# EAGLE design ServoShield (EAGLE 9.6.2)
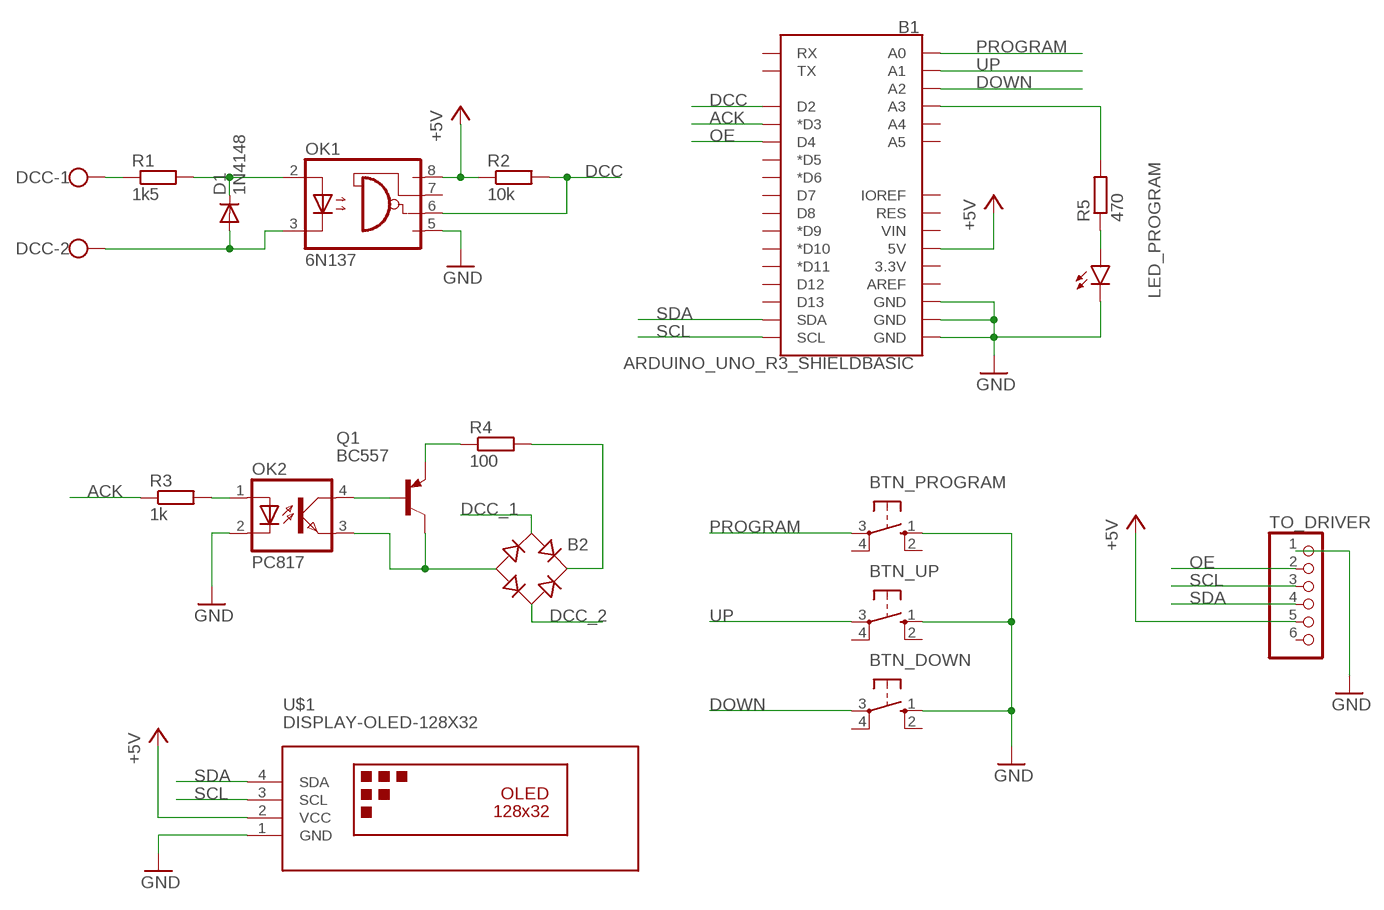
[diagram p0: schematic, sheet 1]

## Parts
B1  ARDUINO_UNO_R3_SHIELDBASIC  [UNO_R3_SHIELD]
B2  RB1A  [RB1A]
BTN_DOWN  10-XX  [B3F-10XX]
BTN_PROGRAM  10-XX  [B3F-10XX]
BTN_UP  10-XX  [B3F-10XX]
D1  1N4148  1N4148DO35-7  [DO35-7]
DCC  W237-102  [W237-102]
LED_PROGRAM  LED3MM  [LED3MM]
OK1  6N137  [DIL08]
OK2  PC817  [DIL04]
Q1  BC557  [TO92]
R1  1k5  R-EU_0207/2V  [0207/2V]
R2  10k  R-EU_0207/2V  [0207/2V]
R3  1k  R-EU_0207/2V  [0207/2V]
R4  100  R-EU_0207/2V  [0207/2V]
R5  470  R-EU_0207/2V  [0207/2V]
TO_DRIVER  PINHD-1X6  [1X06]
U$1  DISPLAY-OLED-128X32  [DISPLAY-OLED-128X32]

## Nets
+5V: B1.5V OK1.8(VCC) R2.1 TO_DRIVER.5 U$1.2(VCC)
ACK: B1.D3(*D3) R3.1
DCC [dcc]: B1.D2 OK1.6(VO) R2.2
DCC_1 [dcc]: B2.AC1 DCC.1 R1.1
DCC_2 [dcc]: B2.AC2 D1.A DCC.2 OK1.3(C)
DOWN: B1.A2 BTN_DOWN.3(P)
GND: B1.GND@0(GND) B1.GND@1(GND) B1.GND@2(GND) BTN_DOWN.1(S) BTN_PROGRAM.1(S) BTN_UP.1(S) LED_PROGRAM.K(C) OK1.5(GND) OK2.2(C) TO_DRIVER.1 U$1.1(GND)
N$1: B2.- OK2.3(EMIT) Q1.3(C)
N$2: D1.C OK1.2(A) R1.2
N$3: B1.A3 R5.2
N$4: LED_PROGRAM.A R5.1
N$8: OK2.1(A) R3.2
N$9: OK2.4(COL) Q1.2(B)
N$10: Q1.1(E) R4.1
N$11: B2.+ R4.2
OE: B1.D4 TO_DRIVER.2
PROGRAM: B1.A0 BTN_PROGRAM.3(P)
SCL: B1.SCL TO_DRIVER.3 U$1.3(SCL)
SDA: B1.SDA TO_DRIVER.4 U$1.4(SDA)
UP: B1.A1 BTN_UP.3(P)
Unconnected: B1.3.3V B1.A4 B1.A5 B1.AREF B1.D5(*D5) B1.D6(*D6) B1.D7 B1.D8 B1.D9(*D9) B1.D10(*D10) B1.D11(*D11) B1.D12 B1.D13 B1.IOREF B1.RES B1.RX B1.TX B1.VIN BTN_DOWN.2(S1) BTN_DOWN.4(P1) BTN_PROGRAM.2(S1) BTN_PROGRAM.4(P1) BTN_UP.2(S1) BTN_UP.4(P1) OK1.7(VE) TO_DRIVER.6

## Library data of the parts
B1 = SparkFun-Boards:ARDUINO_UNO_R3_SHIELD: Arduino R3 Shield Footprint Shield form compatible with the Arduino Uno R3. SparkFun Products: MG2639 Cellular Shield <https://www.sparkfun.com/products/13120> MIDI Shield <https://www.sparkfun.com/products/12898> R3 Stackable Headers Kit <https://www.sparkfun.com/products/11417>
B2 = rectifier:RB1A: RECTIFIER 1 A
BTN_DOWN BTN_PROGRAM BTN_UP = switch-omron:10-XX: OMRON SWITCH; MPN: B3F-1000; OC_FARNELL: 176432; OC_NEWARK: 36M3542
D1 = diode:1N4148: DIODE high speed (Philips)
DCC = con-wago-500:W237-102: WAGO SCREW CLAMP; MPN: 237-102; OC_FARNELL: unknown; OC_NEWARK: 70K9898
LED_PROGRAM = led:LED: LED OSRAM: - CHIPLED LG R971, LG N971, LY N971, LG Q971, LY Q971, LO R971, LY R971 LH N974, LH R974 LS Q976, LO Q976, LY Q976 LO Q996 - Hyper CHIPLED LW Q18S LB Q993, LB Q99A, LB R99A - SideLED LS A670, LO A670, LY A670, LG A670, LP A670 LB A673, LV A673, LT A673, LW A673 LH A674 LY A675 LS A676, LA A676, LO A676, LY A676, LW A676 LS A679, LY A679, LG A679 - Hyper Micro SIDELED® LS Y876, LA Y876, LO Y876, LY Y876 LT Y87S - SmartLED LW L88C, LW L88S LB L89C, LB L89S, LG L890 LS L89K, LO L89K, LY L89K LS L896, LA L896, LO L896, LY L896 - TOPLED LS T670, LO T670, LY T670, LG T670, LP T670 LSG T670, LSP T670, LSY T670, LOP T670, LYG T670 LG T671, LOG T671, LSG T671 LB T673, LV T673, LT T673, LW T673 LH T674 LS T676, LA T676, LO T676, LY T676, LB T676, LH T676, LSB T676, LW T676 LB T67C, LV T67C, LT T67C, LS T67K, LO T67K, LY T67K, LW E67C LS E67B, LA E67B, LO E67B, LY E67B, LB E67C, LV E67C, LT E67C LW T67C LS T679, LY T679, LG T679 LS T770, LO T770, LY T770, LG T770, LP T770 LB T773, LV T773, LT T773, LW T773 LH T774 LS E675, LA E675, LY E675, LS T675 LS T776, LA T776, LO T776, LY T776, LB T776 LHGB T686 LT T68C, LB T68C - Hyper Mini TOPLED® LB M676 - Mini TOPLED Santana® LG M470 LS M47K, LO M47K, LY M47K Source: http://www.osram.convergy.de LUXEON: - LUMILED® LXK2-PW12-R00, LXK2-PW12-S00, LXK2-PW14-U00, LXK2-PW14-V00 LXK2-PM12-R00, LXK2-PM12-S00, LXK2-PM14-U00 LXK2-PE12-Q00, LXK2-PE12-R00, LXK2-PE12-S00, LXK2-PE14-T00, LXK2-PE14-U00 LXK2-PB12-K00, LXK2-PB12-L00, LXK2-PB12-M00, LXK2-PB14-N00, LXK2-PB14-P00, LXK2-PB14-Q00 LXK2-PR12-L00, LXK2-PR12-M00, LXK2-PR14-Q00, LXK2-PR14-R00 LXK2-PD12-Q00, LXK2-PD12-R00, LXK2-PD12-S00 LXK2-PH12-R00, LXK2-PH12-S00 LXK2-PL12-P00, LXK2-PL12-Q00, LXK2-PL12-R00 Source: www.luxeon.com KINGBRIGHT: KA-3528ASYC Source: www.kingbright.com
OK1 = optocoupler:6N137: MOTOROLA OPTO COUPLER; MPN: 6N137; OC_FARNELL: 1328376; OC_NEWARK: 52M1895
OK2 = optocoupler:PC817: SHARP OPTO COUPLER; MPN: PC817X4J000F; OC_FARNELL: 9707727; OC_NEWARK: 97K7059
Q1 = transistor-pnp:BC557: PNP Transistor
R1-R5 = rcl:R-EU_: RESISTOR, European symbol
TO_DRIVER = pinhead:PINHD-1X6: PIN HEADER
U$1 = diy-modules:DISPLAY-OLED-128X32: 128x32 Dot Matrix OLED Module with I2C interface based on SSD1306 chip More details available here: http://www.tinyosshop.com/index.php?route=product/product&product_id=953 Schematic available here: http://www.tinyosshop.com/datasheet/OLED%2012832.pdf SSD1306 datasheet: https://cdn-shop.adafruit.com/datasheets/SSD1306.pdf Click here to find device on ebay.com <http://www.ebay.com/sch/oled+display+128x32+i2c>

## Net classes
1 dcc: width 0.406 mm

## Board
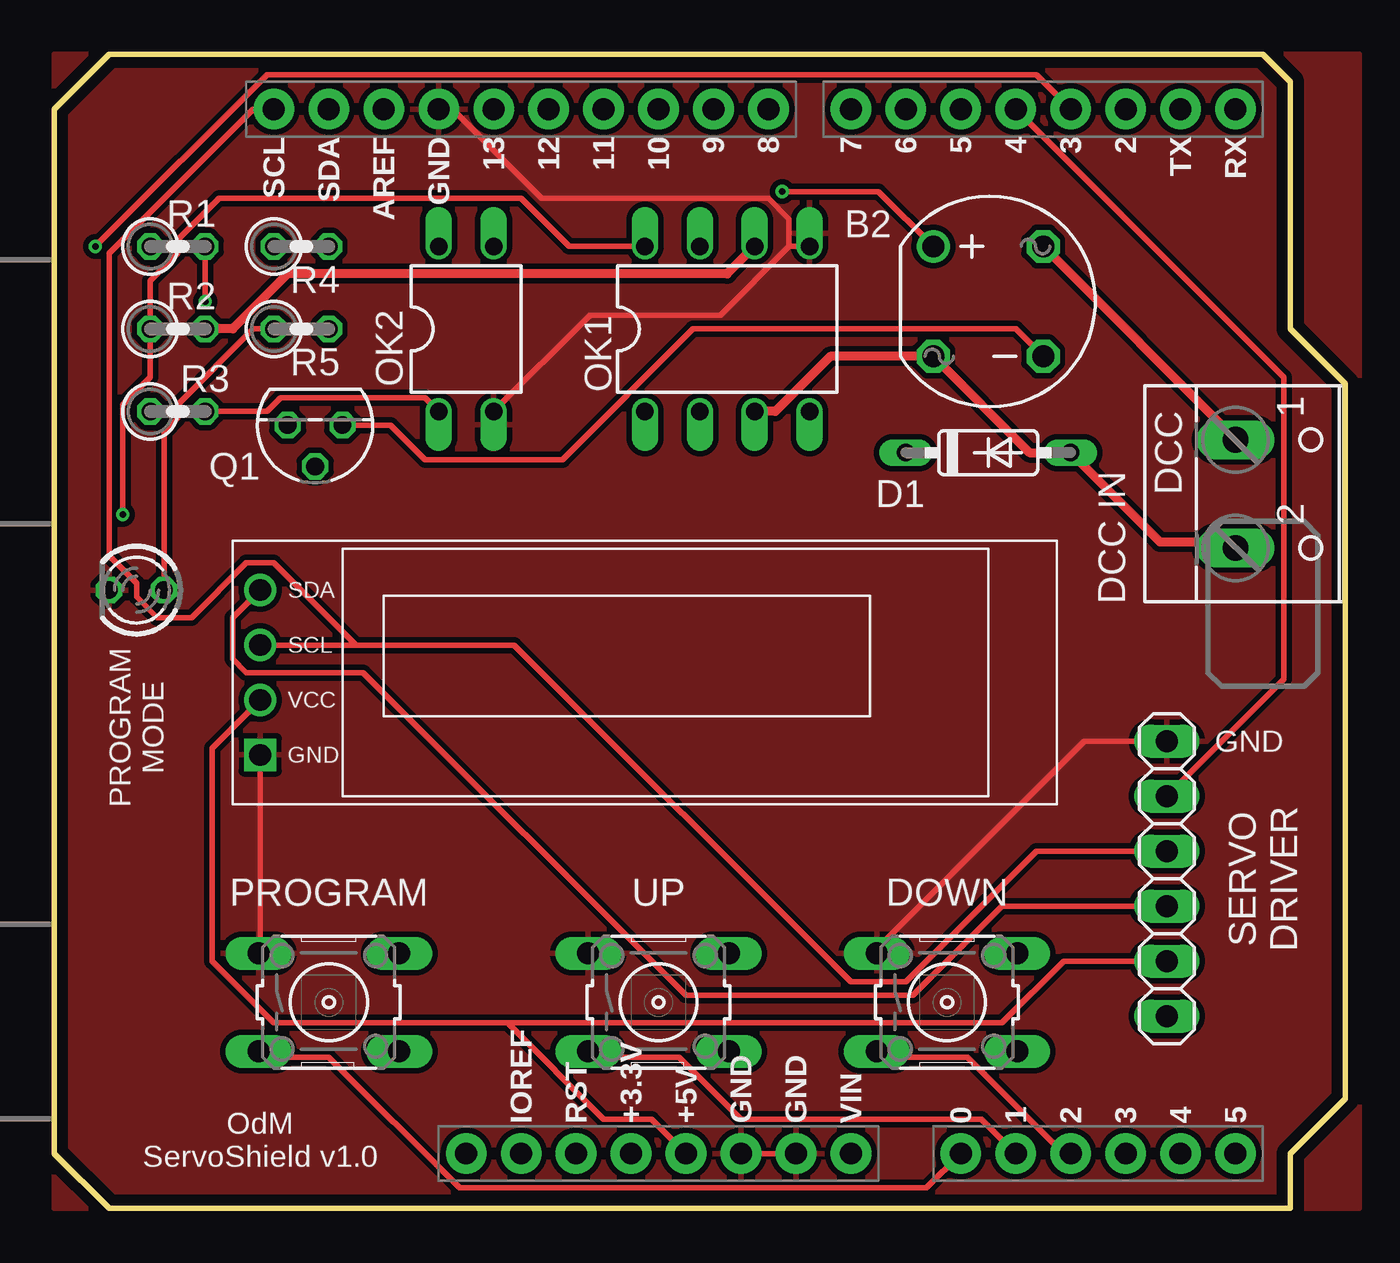
[diagram p1: board, top side]
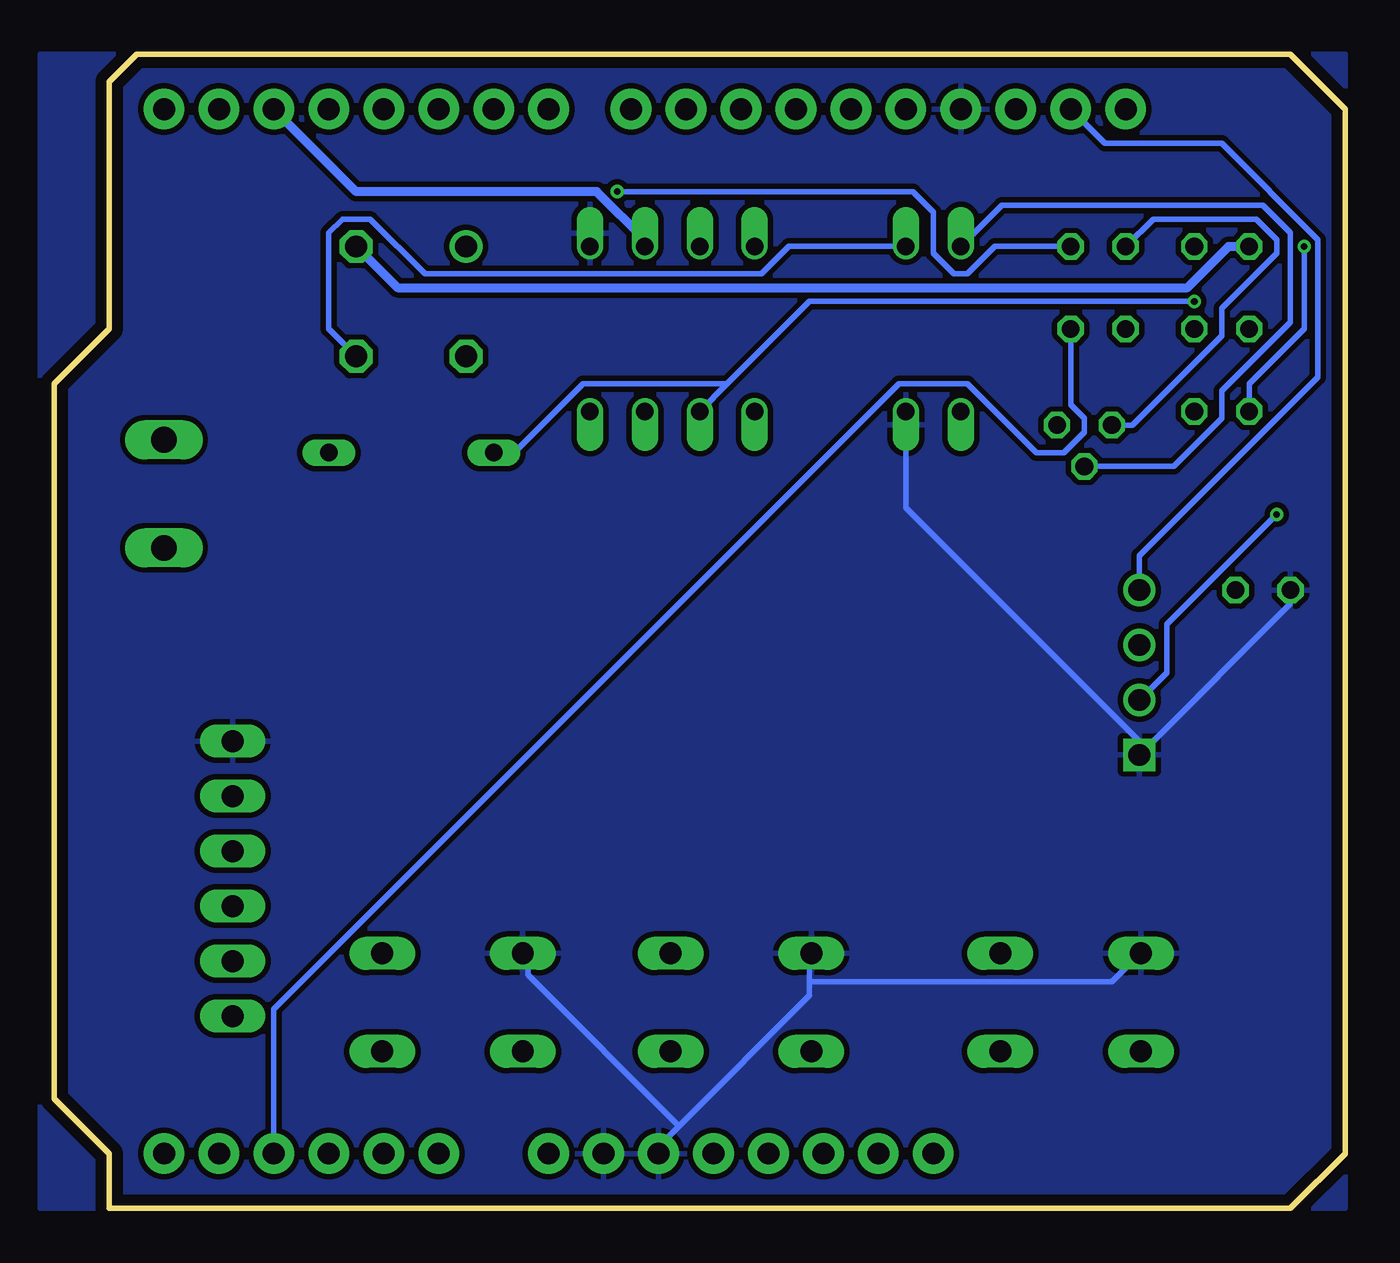
[diagram p2: board, bottom side, seen from below]

Size 59.69 x 53.34 mm. Coordinates in mm from the lower left corner, seen from the top.
Outline: 0,2.54 0,50.8 2.54,53.34 55.88,53.34 57.15,52.07 57.15,40.64 59.69,38.1 59.69,5.08 57.15,2.54 57.15,0 2.54,0 0,2.54
Copper layers (1*16): Top 0.035mm / dielectric 1.6mm / Bottom 0.035mm
Design rules "Elecrow_2-layer_PCB_eagle_rule *": minimum track width 10mil, minimum drill 12mil, track to track 10mil, track to pad 10mil, pad to pad 12mil, via to via 12mil, smd to smd 0mil, copper to edge 20mil, drill to drill 10mil, minimum pad ring 6mil, minimum via ring 6mil, stop-mask expansion 0mil, vias tented up to drill 100mil, thermal gap 10mil

### Footprints (pad centres in the part's own frame; a part is rotated, then mirrored left to right if it is on the bottom)
UNO_R3_SHIELD = drill 1.016 pad 1.88: 3.3V 24.13,-2.54; 5V 24.13,0; A0 24.13,12.7; A1 24.13,15.24; A2 24.13,17.78; A3 24.13,20.32; A4 24.13,22.86; A5 24.13,25.4; AREF -24.13,-13.97; D2 -24.13,20.32; D3 -24.13,17.78; D4 -24.13,15.24; D5 -24.13,12.7; D6 -24.13,10.16; D7 -24.13,7.62; D8 -24.13,3.81; D9 -24.13,1.27; D10 -24.13,-1.27; D11 -24.13,-3.81; D12 -24.13,-6.35; D13 -24.13,-8.89; GND@0 24.13,2.54; GND@1 24.13,5.08; GND@2 -24.13,-11.43; IOREF 24.13,-7.62; NC 24.13,-10.16; RES 24.13,-5.08; RX -24.13,25.4; SCL -24.13,-19.05; SDA -24.13,-16.51; TX -24.13,22.86; VIN 24.13,7.62
RB1A = drill 1.016: + -2.54,2.54 | drill 1.016 octagon: - 2.54,-2.54; AC1 2.54,2.54; AC2 -2.54,-2.54
B3F-10XX = drill 1.016 long: 1 -3.251,2.261; 2 3.251,2.261; 3 -3.251,-2.261; 4 3.251,-2.261
DO35-7 = drill 0.813 long: A 3.81,0; C -3.81,0
W237-102 = drill 1.194 long: 1 -2.5,-1.27; 2 2.5,-1.27
LED3MM = drill 0.813 octagon: A -1.27,0; K 1.27,0
DIL08 = drill 0.813 offset: 1 -3.81,-3.81; 2 -1.27,-3.81; 3 1.27,-3.81; 4 3.81,-3.81; 5 3.81,3.81; 6 1.27,3.81; 7 -1.27,3.81; 8 -3.81,3.81
DIL04 = drill 0.813 offset: 1 -1.27,-3.81; 2 1.27,-3.81; 3 1.27,3.81; 4 -1.27,3.81
TO92 = drill 0.813 octagon: 1 1.27,0; 2 0,1.905; 3 -1.27,0
0207/2V = drill 0.813 octagon: 1 -1.27,0; 2 1.27,0
1X06 = drill 1.016 long: 1 -6.35,0; 2 -3.81,0; 3 -1.27,0; 4 1.27,0; 5 3.81,0; 6 6.35,0
DISPLAY-OLED-128X32 = drill 1 square: 1 -17.78,-3.81 | drill 1: 2 -17.78,-1.27; 3 -17.78,1.27; 4 -17.78,3.81

### Placement (x,y rotation side)
B1  29.21,26.67 270 top
B2  43.18,41.91 0 top
BTN_DOWN  41.27,9.53 0 top
BTN_PROGRAM  12.7,9.53 0 top
BTN_UP  27.94,9.53 0 top
D1  43.18,34.92 0 top
DCC  55.88,33.02 270 top
LED_PROGRAM  3.81,28.57 180 top
OK1  31.11,40.64 0 top
OK2  19.05,40.64 0 top
Q1  12.06,36.2 180 top
R1  5.71,44.45 0 top
R2  5.71,40.64 0 top
R3  5.71,36.83 0 top
R4  11.43,44.45 0 top
R5  11.43,40.64 0 top
TO_DRIVER  51.44,15.24 270 top
U$1  27.3,24.77 0 top

### Tracks (layer width: path | path; a pad name or v marks a point on that pad's centre or on a via)
+5V  (via drill 0.3)
  Top 0.254: OK1.8 23.81,44.45 21.59,46.67 7.62,46.67 5.71,44.77 5.71,44.13 4.45,42.86 R2.1 4.45,38.42 3.17,37.15 v3.17,32.07 | U$1.2 7.3,21.27 7.3,11.43 10.16,8.57 20.95,8.57 | 20.95,8.57 25.4,4.13 27.62,4.13 B1.5V | TO_DRIVER.5 46.67,11.43 43.81,8.57 20.95,8.57
  Bottom 0.254: v3.17,32.07 8.26,26.99 8.26,24.77 U$1.2
ACK  (via drill 0.3)
  Top 0.254: v1.91,44.45 9.84,52.39 45.4,52.39 B1.D3
  Bottom 0.254: R3.1 4.45,38.1 1.91,40.64 v1.91,44.45
DCC
  Top 0.406: R2.2 8.26,40.64 10.79,43.18 31.11,43.18 OK1.6
  Bottom 0.406: B1.D2 45.72,46.99 34.61,46.99 32.38,44.77 OK1.6
DCC_1
  Top 0.406: B2.AC1 54.61,35.56 DCC.1
  Bottom 0.406: R1.1 5.4,44.45 7.3,42.55 43.81,42.55 B2.AC1
DCC_2
  Top 0.406: OK1.3 33.34,36.83 35.88,39.37 B2.AC2 45.09,34.92 D1.A 51.12,30.8 54.61,30.8 DCC.2
DOWN
  Top 0.254: B1.A2 46.67,2.54 42.23,6.99 38.1,6.99 BTN_DOWN.3
GND
  Top 0.254: TO_DRIVER.1 47.62,21.59 38.1,12.06 BTN_DOWN.1 | B1.GND@0 B1.GND@1 | 33.97,44.45 OK1.5 | 33.97,44.45 30.8,41.27 24.77,41.27 OK2.2 | U$1.1 9.53,12.06 BTN_PROGRAM.1 | B1.GND@2 18.41,50.8 22.54,46.67 33.02,46.67 33.97,45.72 33.97,44.45
  Bottom 0.254: 24.77,10.48 24.77,9.84 30.8,3.81 | 24.77,10.48 24.77,11.75 BTN_UP.1 | 30.8,3.81 31.75,2.86 B1.GND@0 | 30.8,3.81 37.78,10.79 37.78,11.75 BTN_DOWN.1 | LED_PROGRAM.K 2.54,27.94 9.21,21.27 | OK2.2 20.32,32.38 9.21,21.27 | 9.21,21.27 U$1.1 | 24.77,10.48 10.79,10.48 9.53,11.75 BTN_PROGRAM.1
  pour Top: 0,53.34 60.33,53.34 60.33,0 0,0
  pour Bottom: 0,53.34 60.33,53.34 60.33,0 0,0
N$1
  Top 0.254: Q1.3 15.56,36.2 17.14,34.61 23.5,34.61 29.53,40.64 44.45,40.64 B2.-
  Bottom 0.254: OK2.3 25.72,44.45 26.99,43.18 42.55,43.18 45.09,45.72 46.35,45.72 46.99,45.09 46.99,40.64 B2.-
N$2  (via drill 0.3)
  Top 0.254: v6.99,41.91 R1.2
  Bottom 0.254: v6.99,41.91 24.77,41.91 28.57,38.1 | OK1.2 28.57,38.1 | D1.C 38.42,34.92 35.24,38.1 28.57,38.1
N$3
  Bottom 0.254: R5.2 12.7,37.15 12.06,36.51 12.06,35.88 13.02,34.92 14.29,34.92 17.46,38.1 20.64,38.1 49.53,9.21 B1.A3
N$4
  Top 0.254: LED_PROGRAM.A 5.08,35.88 5.71,36.51 5.71,37.15 9.21,40.64 R5.1
N$8
  Top 0.254: R3.2 9.84,36.83 10.48,37.47 17.14,37.47 OK2.1
N$9
  Bottom 0.254: Q1.2 7.94,34.29 5.71,36.51 5.71,37.78 2.54,40.96 2.54,45.09 3.81,46.35 15.88,46.35 OK2.4
N$10
  Bottom 0.254: Q1.1 9.84,36.2 5.71,40.32 5.71,41.59 3.17,44.13 3.17,44.77 4.13,45.72 8.89,45.72 R4.1
N$11  (via drill 0.3)
  Top 0.254: v33.66,46.99 38.1,46.99 B2.+
  Bottom 0.254: R4.2 16.19,44.45 17.46,43.18 18.1,43.18 19.05,44.13 19.05,46.04 20,46.99 v33.66,46.99
OE
  Top 0.254: TO_DRIVER.2 56.83,24.45 56.83,38.42 B1.D4
PROGRAM
  Top 0.254: B1.A0 40.32,0.95 18.73,0.95 12.7,6.99 9.53,6.99 BTN_PROGRAM.3
SCL
  Top 0.254: 13.97,26.04 21.27,26.04 36.83,10.48 39.37,10.48 45.4,16.51 TO_DRIVER.3 | 13.97,26.04 U$1.3 | B1.SCL 9.21,50.8 2.54,44.13 2.54,30.16 3.81,28.89 3.81,28.26 4.76,27.3 6.35,27.3 8.89,29.84 10.16,29.84 13.97,26.04
SDA
  Top 0.254: TO_DRIVER.4 43.81,13.97 39.69,9.84 29.21,9.84 14.29,24.77 8.89,24.77 8.26,25.4 8.26,27.3 U$1.4
  Bottom 0.254: U$1.4 9.53,30.16 1.27,38.42 1.27,44.77 5.71,49.21 11.11,49.21 B1.SDA
UP
  Top 0.254: B1.A1 42.86,4.13 31.75,4.13 28.89,6.99 24.77,6.99 BTN_UP.3

### Text on the board
tNames: DCC IN | PROGRAM / MODE | GND | PROGRAM | UP | DOWN | SERVO / DRIVER | OdM / ServoShield v1.0